# Altium schematic sheet eps.SchDoc
size A4
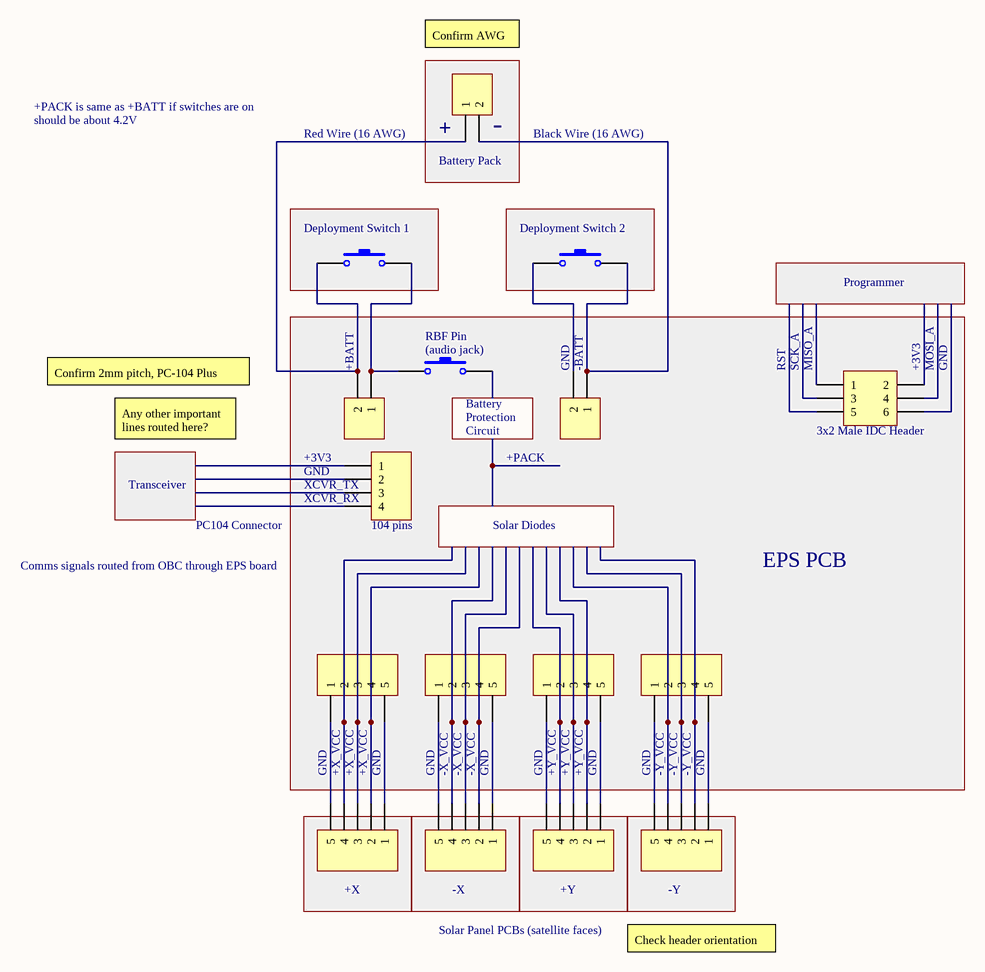
[diagram p0: eps.SchDoc]

## Parts
(Parts that share a designator on the sheet are numbered #1, #2 ... from top to bottom, then left to right.)
P?#1  Header 2  [HDR1X2]  (value not drawn)
P?#2  Header 3X2  [HDR2X3]  (value not drawn)
P?#3  Header 2  [HDR1X2]  (value not drawn)
P?#4  Header 2  [HDR1X2]  (value not drawn)
P?#5  Header 4  [HDR1X4]  (value not drawn)
P?#6  Header 5  [HDR1X5]  (value not drawn)
P?#7  Header 5  [HDR1X5]  (value not drawn)
P?#8  Header 5  [HDR1X5]  (value not drawn)
P?#9  Header 5  [HDR1X5]  (value not drawn)
P?#10  Header 5  [HDR1X5]  (value not drawn)
P?#11  Header 5  [HDR1X5]  (value not drawn)
P?#12  Header 5  [HDR1X5]  (value not drawn)
P?#13  Header 5  [HDR1X5]  (value not drawn)
S?#1  SW-PB  [SPST-2]  (value not drawn)
S?#2  SW-PB  [SPST-2]  (value not drawn)
S?#3  SW-PB  [SPST-2]  (value not drawn)

## Blocks framed on the sheet
-: P?#1
Deployment Switch 1: S?#1
Deployment Switch 2: S?#2
EPS PCB: P?#2-P?#9 S?#3
+X: P?#10
-X: P?#11
+Y: P?#12
-Y: P?#13

## Nets
NetP?#1_1: P?#1.1 P?#3.2 S?#1.1
NetP?#1_2: P?#1.2 P?#4.1 S?#2.2
NetP?#3_1: P?#3.1 S?#1.2 S?#3.1
NetP?#4_2: P?#4.2 S?#2.1
NetP?#6_1: P?#6.1 P?#10.5
NetP?#6_2: P?#6.2 P?#10.4
NetP?#6_3: P?#6.3 P?#10.3
NetP?#6_4: P?#6.4 P?#10.2
NetP?#6_5: P?#6.5 P?#10.1
NetP?#7_1: P?#7.1 P?#11.5
NetP?#7_2: P?#7.2 P?#11.4
NetP?#7_3: P?#7.3 P?#11.3
NetP?#7_4: P?#7.4 P?#11.2
NetP?#7_5: P?#7.5 P?#11.1
NetP?#8_1: P?#8.1 P?#12.5
NetP?#8_2: P?#8.2 P?#12.4
NetP?#8_3: P?#8.3 P?#12.3
NetP?#8_4: P?#8.4 P?#12.2
NetP?#8_5: P?#8.5 P?#12.1
NetP?#9_1: P?#9.1 P?#13.5
NetP?#9_2: P?#9.2 P?#13.4
NetP?#9_3: P?#9.3 P?#13.3
NetP?#9_4: P?#9.4 P?#13.2
NetP?#9_5: P?#9.5 P?#13.1

Not connected (* = marked no-connect by the designer): P?#2 1 2 3 4 5 6; P?#5 1 2 3 4; S?#3 2

## Notes on the sheet
- Confirm AWG
- +PACK is same as +BATT if switches are on
- should be about 4.2V
- Red Wire (16 AWG)
- (near P?#1) +
- Black Wire (16 AWG)
- (near P?#1) Battery Pack
- Programmer
- (near S?#3) (audio jack)
- (near S?#3) RBF Pin
- Confirm 2mm pitch, PC-104 Plus
- (near P?#3) +BATT
- (near S?#3) Battery
- Protection
- (near P?#4) GND
- (near P?#4) -BATT
- RST
- (near P?#2) SCK_A
- (near P?#2) MISO_A
- (near P?#2) +3V3
- (near P?#2) MOSI_A
- (near P?#2) GND
- Any other important lines routed here?
- Transceiver
- (near P?#5) +3V3
- (near P?#5) GND
- (near P?#5) XCVR_TX
- Circuit
- +PACK
- (near P?#2) 3x2 Male IDC Header
- PC104 Connector
- (near P?#5) XCVR_RX
- (near P?#5) 104 pins
- Solar Diodes
- Comms signals routed from OBC through EPS board
- GND
- (near P?#6) +X_VCC
- (near P?#7) -X_VCC
- (near P?#8) +Y_VCC
- (near P?#9) -Y_VCC
- Solar Panel PCBs (satellite faces)
- Check header orientation

## Library data of the parts
P?#1 P?#3 P?#4 = Header 2: Header, 2-Pin; LatestRevisionDate: 17-Jul-2002; LatestRevisionNote: Re-released for DXP Platform.; Publisher: Altium Limited
P?#2 = Header 3X2: Header, 3-Pin, Dual row; LatestRevisionDate: 17-Jul-2002; LatestRevisionNote: Re-released for DXP Platform.; Publisher: Altium Limited
P?#5 = Header 4: Header, 4-Pin; LatestRevisionDate: 17-Jul-2002; LatestRevisionNote: Re-released for DXP Platform.; Publisher: Altium Limited
P?#6-P?#13 = Header 5: Header, 5-Pin; LatestRevisionDate: 17-Jul-2002; LatestRevisionNote: Re-released for DXP Platform.; Publisher: Altium Limited
S?#1-S?#3 = SW-PB: Switch; Published: 24-Mar-1999; LatestRevisionDate: 17-Jul-2002; LatestRevisionNote: Re-released for DXP Platform.; PackageReference: SPST-2; Publisher: Altium Limited; PackageDescription: Switch; 2 Leads